# Altium project connector_boards.PrjPcb
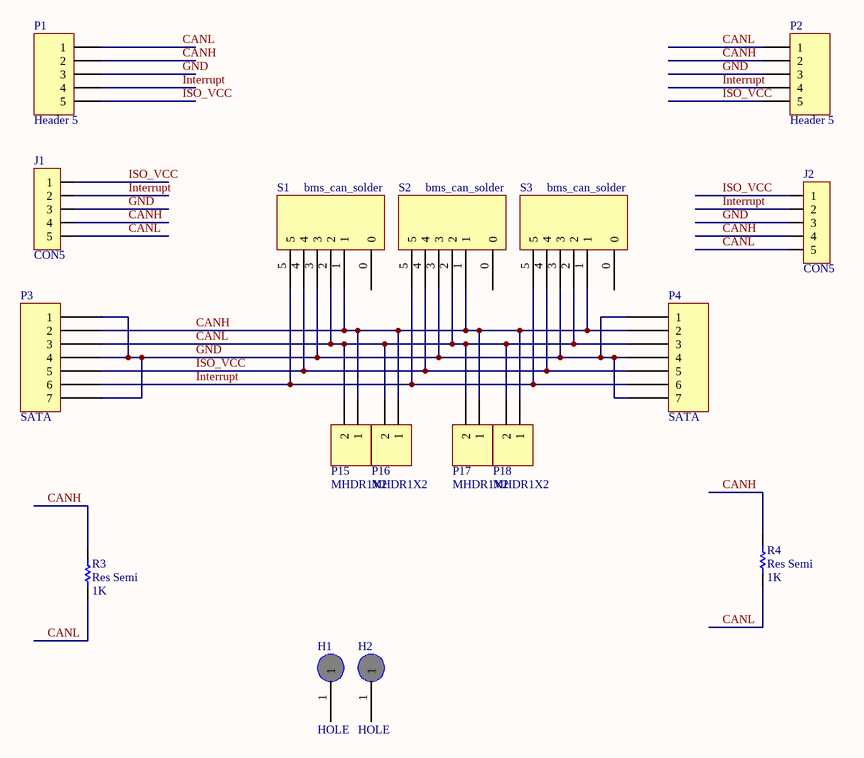
[diagram p0: connector_boards.SchDoc]
1 sheet, 17 parts. Net scope: global (net labels, ports and power ports of the same name join across sheets).
Board file: connector_boards.PcbDoc

## Sheet connector_boards.SchDoc
size A

### Parts
H1  HOLE  [M2.5]
H2  HOLE  [M2.5]
J1  CON5  [TRIAD5F]
J2  CON5  [TRIAD5F]
P1  Header 5  [HDR1X5]
P2  Header 5  [HDR1X5]
P3  SATA  [47080-4005-SATA]
P4  SATA  [47080-4005-SATA]
P15  MHDR1X2  [MHDR1X2]
P16  MHDR1X2  [MHDR1X2]
P17  MHDR1X2  [MHDR1X2]
P18  MHDR1X2  [MHDR1X2]
R3  Res Semi  value 1K  [1005[0402]]
R4  Res Semi  value 1K  [1005[0402]]
S1  bms_can_solder  [pcb_bcan_soldertabs]
S2  bms_can_solder  [pcb_bcan_soldertabs]
S3  bms_can_solder  [pcb_bcan_soldertabs]

### Nets
CANH: J1.4 J2.4 P1.2 P2.2 P3.2 P4.2 P15.1 P16.1 P17.1 P18.1 R3.2 R4.2 S1.1 S2.1 S3.1
CANL: J1.5 J2.5 P1.1 P2.1 P3.3 P4.3 P15.2 P16.2 P17.2 P18.2 R3.1 R4.1 S1.2 S2.2 S3.2
GND: J1.3 J2.3 P1.3 P2.3 P3.1 P3.4 P3.7 P4.1 P4.4 P4.7 S1.3 S2.3 S3.3
Interrupt: J1.2 J2.2 P1.4 P2.4 P3.6 P4.6 S1.5 S2.5 S3.5
ISO_VCC: J1.1 J2.1 P1.5 P2.5 P3.5 P4.5 S1.4 S2.4 S3.4

Not connected (* = marked no-connect by the designer): H1 1; H2 1; S1 0; S2 0; S3 0

### Library data of the parts
J1 J2 = CON5: Connector
P1 P2 = Header 5: Header, 5-Pin; LatestRevisionDate: 17-Jul-2002; LatestRevisionNote: Re-released for DXP Platform.; Publisher: Altium Limited
P15-P18 = MHDR1X2: Header, 2-Pin; LatestRevisionDate: 17-Jul-2002; LatestRevisionNote: Re-released for DXP Platform.; Publisher: Altium Limited
R3 R4 = Res Semi: Semiconductor Resistor; Published: 8-Jun-2000; LatestRevisionDate: 17-Jul-2002; LatestRevisionNote: Re-released for DXP Platform.; PackageReference: AXIAL-0.5; Publisher: Altium Limited